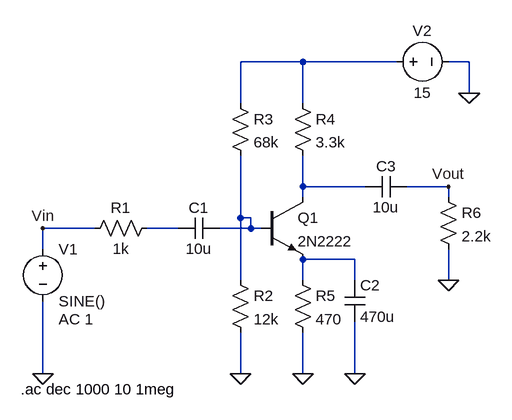
[diagram p0: schematic Draft3.asc]
Draft3.asc, the LTspice schematic file:
Version 4
SHEET 1 880 680
WIRE 384 -160 288 -160
WIRE 528 -160 384 -160
WIRE 640 -160 608 -160
WIRE 640 -112 640 -160
WIRE 288 -96 288 -160
WIRE 384 -96 384 -160
WIRE 384 32 384 -16
WIRE 480 32 384 32
WIRE 608 32 544 32
WIRE 384 48 384 32
WIRE 608 48 608 32
WIRE 288 80 288 -16
WIRE 304 80 288 80
WIRE 64 96 -16 96
WIRE 192 96 144 96
WIRE 304 96 304 80
WIRE 304 96 256 96
WIRE 320 96 304 96
WIRE -16 128 -16 96
WIRE 464 144 384 144
WIRE 288 176 288 80
WIRE 384 176 384 144
WIRE 464 176 464 144
WIRE 608 176 608 128
WIRE -16 320 -16 208
WIRE 288 320 288 256
WIRE 384 320 384 256
WIRE 464 320 464 240
FLAG 640 -112 0
FLAG 608 176 0
FLAG 288 320 0
FLAG 384 320 0
FLAG -16 320 0
FLAG 464 320 0
FLAG 608 32 Vout
FLAG -16 96 Vin
SYMBOL cap 256 80 R90
WINDOW 0 0 32 VBottom 2
WINDOW 3 32 32 VTop 2
SYMATTR InstName C1
SYMATTR Value 10u
SYMBOL res 272 160 R0
SYMATTR InstName R2
SYMATTR Value 12k
SYMBOL res 272 -112 R0
SYMATTR InstName R3
SYMATTR Value 68k
SYMBOL res 368 -112 R0
SYMATTR InstName R4
SYMATTR Value 3.3k
SYMBOL res 368 160 R0
SYMATTR InstName R5
SYMATTR Value 470
SYMBOL cap 448 176 R0
SYMATTR InstName C2
SYMATTR Value 470u
SYMBOL cap 544 16 R90
WINDOW 0 0 32 VBottom 2
WINDOW 3 32 32 VTop 2
SYMATTR InstName C3
SYMATTR Value 10u
SYMBOL res 592 32 R0
SYMATTR InstName R6
SYMATTR Value 2.2k
SYMBOL voltage 512 -160 R270
WINDOW 0 32 56 VTop 2
WINDOW 3 -32 56 VBottom 2
WINDOW 123 0 0 Left 0
WINDOW 39 0 0 Left 0
SYMATTR InstName V2
SYMATTR Value 15
SYMBOL res 160 80 R90
WINDOW 0 0 56 VBottom 2
WINDOW 3 32 56 VTop 2
SYMATTR InstName R1
SYMATTR Value 1k
SYMBOL voltage -16 112 R0
WINDOW 123 24 124 Left 2
WINDOW 39 0 0 Left 0
SYMATTR InstName V1
SYMATTR Value SINE()
SYMATTR Value2 AC 1
SYMBOL npn 320 48 R0
SYMATTR InstName Q1
SYMATTR Value 2N2222
TEXT -50 344 Left 2 !.ac dec 1000 10 1meg

The netlist it stands for:
* Draft3.asc
C1 N003 N004 10u
R2 N003 0 12k
R3 N001 N003 68k
R4 N001 N002 3.3k
R5 N005 0 470
C2 N005 0 470u
C3 Vout N002 10u
R6 Vout 0 2.2k
V2 N001 0 15
R1 N004 Vin 1k
V1 Vin 0 SINE() AC 1
Q1 N002 N003 N005 0 2N2222
.model NPN NPN
.model PNP PNP
.lib standard.bjt
.ac dec 1000 10 1meg
.backanno
.end